# Altium schematic sheet Device.SchDoc
size A4
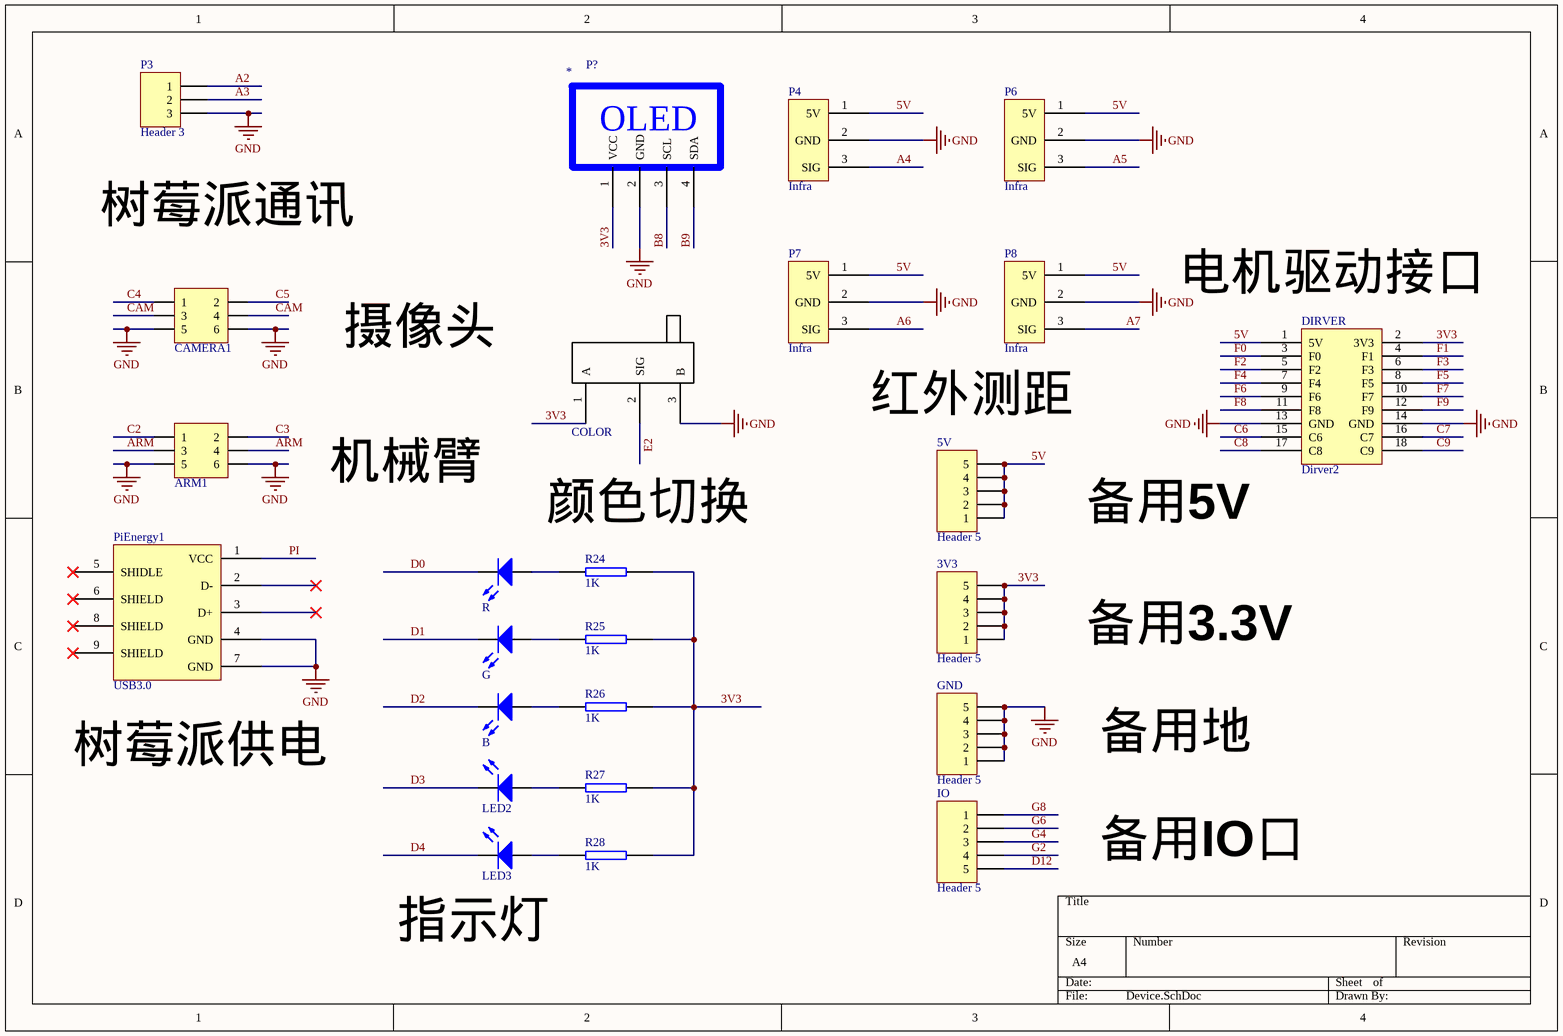
[diagram p0: Device.SchDoc]

## Parts
3V3  Header 5  [HDR1X5]
5V  Header 5  [HDR1X5]
*  P?  [OLED]
ARM1  Header3X2  [HDR-3X2]  (value not drawn)
B  LED0  [LED[0805]]  (value not drawn)
CAMERA1  Header3X2  [HDR-3X2]  (value not drawn)
COLOR  COLOR  [KEY]
DIRVER  Dirver2  [DIRVER2]
G  LED0  [LED[0805]]  (value not drawn)
GND  Header 5  [HDR1X5]
IO  Header 5  [HDR1X5]
LED2  LED0  [LED[0805]]  (value not drawn)
LED3  LED0  [LED[0805]]  (value not drawn)
P3  Header 3  [HDR1X3]
P4  Infra  [Infra]
P6  Infra  [Infra]
P7  Infra  [Infra]
P8  Infra  [Infra]
PiEnergy1  USB3.0  [USB3.0]
R  LED0  [LED[0805]]  (value not drawn)
R24  1K  [R0805]
R25  1K  [R0805]
R26  1K  [R0805]
R27  1K  [R0805]
R28  1K  [R0805]

## Nets
GND: *.2(GND) ARM1.5 ARM1.6 CAMERA1.5 CAMERA1.6 COLOR.3(B) DIRVER.13(GND) DIRVER.14(GND) GND.1 GND.2 GND.3 GND.4 GND.5 P3.3 P4.2(GND) P6.2(GND) P7.2(GND) P8.2(GND) PiEnergy1.4(GND) PiEnergy1.7(GND)
3V3: 3V3.1 3V3.2 3V3.3 3V3.4 3V3.5 *.1(VCC) COLOR.1(A) DIRVER.2(3V3) R24.2 R25.2 R26.2 R27.1 R28.1
5V: 5V.1 5V.2 5V.3 5V.4 5V.5 DIRVER.1(5V) P4.1(5V) P6.1(5V) P7.1(5V) P8.1(5V)
A2: P3.1
A3: P3.2
A4: P4.3(SIG)
A5: P6.3(SIG)
A6: P7.3(SIG)
A7: P8.3(SIG)
ARM: ARM1.3 ARM1.4
B8: *.3(SCL)
B9: *.4(SDA)
C2: ARM1.1
C3: ARM1.2
C4: CAMERA1.1
C5: CAMERA1.2
C6: DIRVER.15(C6)
C7: DIRVER.16(C7)
C8: DIRVER.17(C8)
C9: DIRVER.18(C9)
CAM: CAMERA1.3 CAMERA1.4
D0: R.2(K)
D1: G.2(K)
D2: B.2(K)
D3: LED2.2(K)
D4: LED3.2(K)
D12: IO.5
E2: COLOR.2(SIG)
F0: DIRVER.3(F0)
F1: DIRVER.4(F1)
F2: DIRVER.5(F2)
F3: DIRVER.6(F3)
F4: DIRVER.7(F4)
F5: DIRVER.8(F5)
F6: DIRVER.9(F6)
F7: DIRVER.10(F7)
F8: DIRVER.11(F8)
F9: DIRVER.12(F9)
G2: IO.4
G4: IO.3
G6: IO.2
G8: IO.1
PI: PiEnergy1.1(VCC)
NetB_1: B.1(A) R26.1
NetG_1: G.1(A) R25.1
NetLED2_1: LED2.1(A) R27.2
NetLED3_1: LED3.1(A) R28.2
NetR_1: R.1(A) R24.1

Not connected (* = marked no-connect by the designer): PiEnergy1 2(D-)* 3(D+)* 5(SHIDLE)* 6(SHIELD)* 8(SHIELD)* 9(SHIELD)*

## Notes on the sheet
- 树莓派通讯
- (near DIRVER) 电机驱动接口
- 摄像头
- 红外测距
- 机械臂
- 颜色切换
- 备用5V
- 备用3.3V
- (near PiEnergy1) 树莓派供电
- 备用地
- 备用IO口
- (near LED3) 指示灯

## Library data of the parts
3V3 5V GND IO = Header 5: Header, 5-Pin; LatestRevisionDate: 17-Jul-2002; LatestRevisionNote: Re-released for DXP Platform.; Publisher: Altium Limited
* = OLED
ARM1 CAMERA1 = Header 3X2: 3*2P接插件; 版权归属: 源创客; BOM名称: 3*2P接插件; 学习资源: www.ooocke.com
COLOR = key
P3 = Header 3: Header, 3-Pin; LatestRevisionDate: 17-Jul-2002; LatestRevisionNote: Re-released for DXP Platform.; Publisher: Altium Limited
R24-R28 = RES